# Altium schematic sheet specification.SchDoc
size A; SheetNumber: 5; SheetTotal: 5
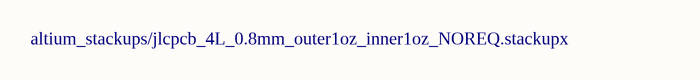
[diagram p0: specification.SchDoc]

## Notes on the sheet
- altium_stackups/jlcpcb_4L_0.8mm_outer1oz_inner1oz_NOREQ.stackupx